# Altium schematic sheet 4_adc.SchDoc: Analog Inputs
size A4; DocumentNumber: 5; SheetNumber: 5; SheetTotal: 11
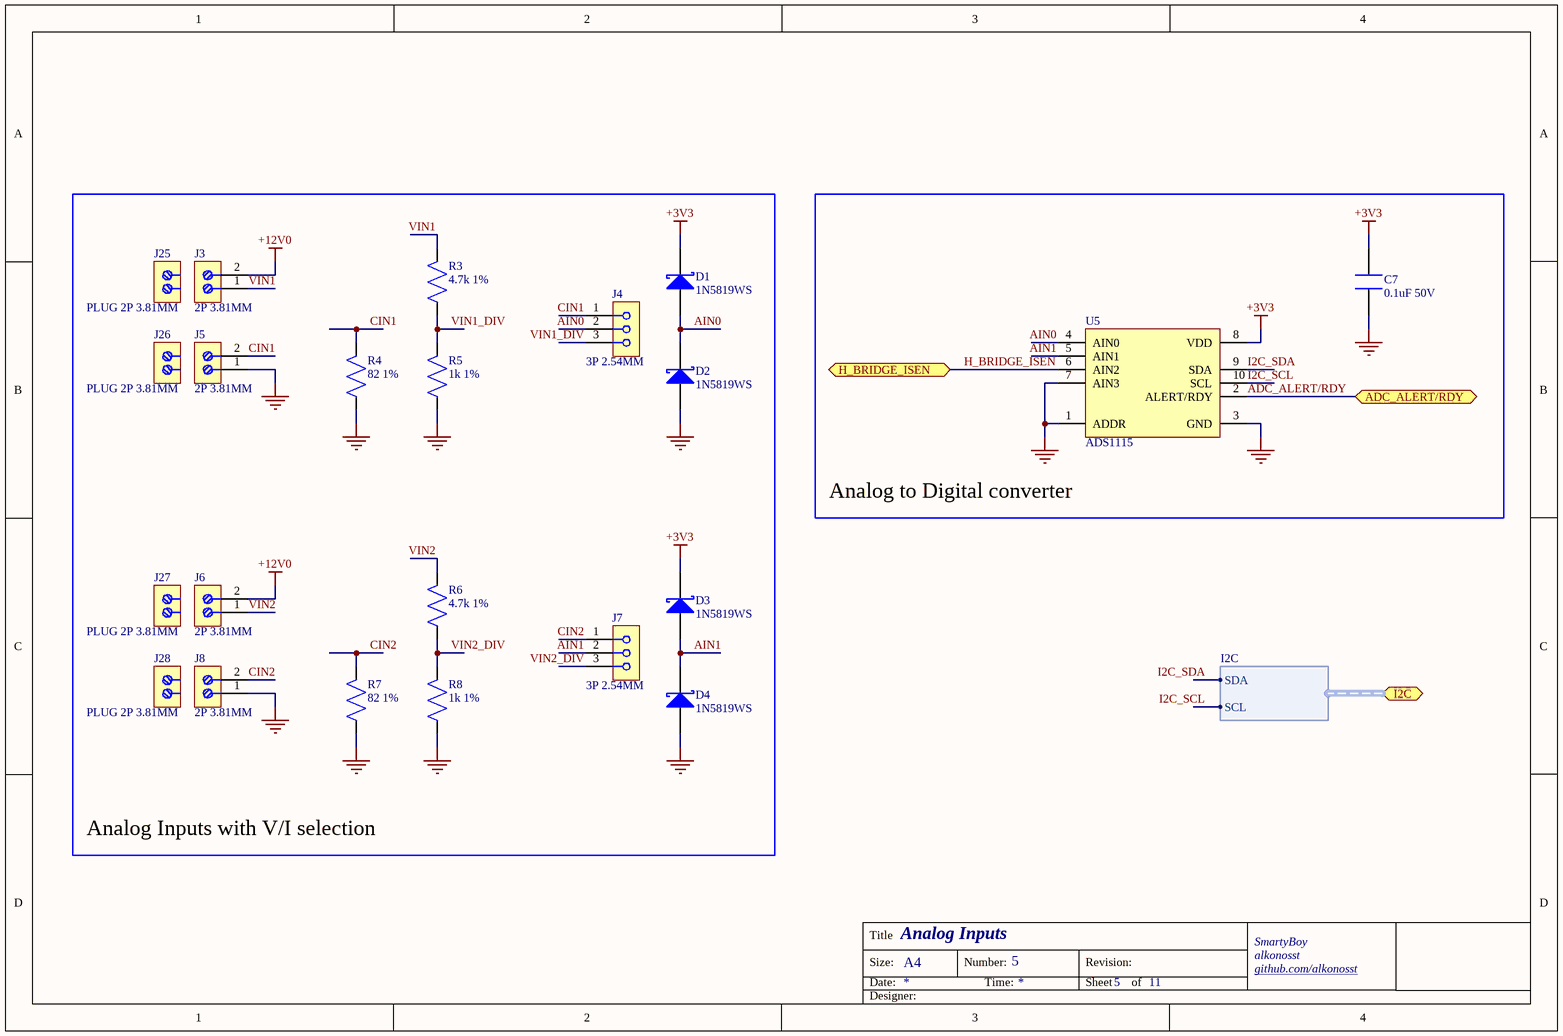
[diagram p0: 4_adc.SchDoc]

## Parts
C7  0.1uF 50V  [C0603]
D1  1N5819WS  [SOD-323]
D2  1N5819WS  [SOD-323]
D3  1N5819WS  [SOD-323]
D4  1N5819WS  [SOD-323]
J3  2P 3.81MM  [TB-2P-3.81MM]  (no BOM)
J4  3P 2.54MM  [HDR-M-3P-2.54MM]
J5  2P 3.81MM  [TB-2P-3.81MM]  (no BOM)
J6  2P 3.81MM  [TB-2P-3.81MM]  (no BOM)
J7  3P 2.54MM  [HDR-M-3P-2.54MM]
J8  2P 3.81MM  [TB-2P-3.81MM]  (no BOM)
J25  PLUG 2P 3.81MM  [TB-PLUG-2P-3.81MM]  (no BOM)
J26  PLUG 2P 3.81MM  [TB-PLUG-2P-3.81MM]  (no BOM)
J27  PLUG 2P 3.81MM  [TB-PLUG-2P-3.81MM]  (no BOM)
J28  PLUG 2P 3.81MM  [TB-PLUG-2P-3.81MM]  (no BOM)
R3  4.7k 1%  [R0603]
R4  82 1%  [R0603]
R5  1k 1%  [R0603]
R6  4.7k 1%  [R0603]
R7  82 1%  [R0603]
R8  1k 1%  [R0603]
U5  ADS1115  [MSOP-10]

## Blocks framed on the sheet
Analog Inputs with V/I selection: D1-D4 J3-J8 J25-J28 R3-R8
Analog to Digital converter: C7 U5

## Ports
ADC_ALERT/RDY (bidir), H_BRIDGE_ISEN (bidir), I2C (bidir, harness I2C)

## Harnesses
I2C: SDA, SCL

## Nets
+3V3: C7.1 D1.1(K) D3.1(K) U5.8(VDD)
+12V0: J3.2 J6.2
GND: C7.2 D2.2(A) D4.2(A) J5.1 J8.1 R4.1 R5.1 R7.1 R8.1 U5.1(ADDR) U5.3(GND) U5.7(AIN3)
ADC_ALERT/RDY: U5.2(ALERT/RDY) ; port ADC_ALERT/RDY
AIN0: D1.2(A) D2.1(K) J4.2 U5.4(AIN0)
AIN1: D3.2(A) D4.1(K) J7.2 U5.5(AIN1)
CIN1: J4.1 J5.2 R4.2
CIN2: J7.1 J8.2 R7.2
H_BRIDGE_ISEN: U5.6(AIN2) ; port H_BRIDGE_ISEN
I2C_SCL: U5.10(SCL) ; port I2C.SCL
I2C_SDA: U5.9(SDA) ; port I2C.SDA
VIN1: J3.1 R3.2
VIN1_DIV: J4.3 R3.1 R5.2
VIN2: J6.1 R6.2
VIN2_DIV: J7.3 R6.1 R8.2

## Notes on the sheet
- Title
- Size:
- Date:
- A4
- Number:
- Time:
- Revision:
- Sheet
- of
- SmartyBoy
- alkonosst
- github.com/alkonosst <http://github.com/alkonosst>
- Designer:

## Library data of the parts
C7 = CC0603KRX7R9BB104: X7R 100nF ±10% 50V 0603 Multilayer Ceramic Capacitors MLCC - SMD/SMT; LCSC part: C14663; Category: Capacitors: Multilayer Ceramic Capacitors MLCC - SMD/SMT
D1-D4 = 1N5819WS: 40V 1A 600mV @ 1A SOD-323 Schottky Barrier Diodes (SBD); LCSC part: C191023; Category: Diodes: Schottky Barrier Diodes (SBD)
J3 J5 J6 J8 = TBLOCK-2P-3.81MM: Terminal Block 2 Positions 3.81MM; Category: Connectors: Pluggable System Terminal Block
J4 J7 = C49257: 3 2.54mm Straight 1 Header，Breakaway Through Hole Pin Header & Female Header; LCSC part: C49257; Category: Connectors: Pin Header & Female Header
J25-J28 = PLUG-2P-3.81MM: Terminal block plug 2positions 3.81mm; Category: Connectors: Pluggable System Terminal Block
R3 R6 = 0603WAF4701T5E: ±1% 4.7kΩ ±100ppm/℃ 0.1W 0603 Chip Resistor - Surface Mount; LCSC part: C23162; Category: Resistors: Chip Resistor - Surface Mount
R4 R7 = 0603WAF820JT5E: 82Ω ±1% ±200ppm/℃ 0.1W 0603 Chip Resistor - Surface Mount; LCSC part: C23255; Category: Resistors: Chip Resistor - Surface Mount
R5 R8 = 0603WAF1001T5E: ±1% ±100ppm/℃ 1kΩ 0.1W 0603 Chip Resistor - Surface Mount; LCSC part: C21190; Category: Resistors: Chip Resistor - Surface Mount
U5 = ADS1115IDGSR: 2,4 Differential, Single Ended 16 860 VSSOP-10 Analog To Digital Converters (ADCs); LCSC part: C37593; Category: Data Converters: Analog To Digital Converters (ADCs)